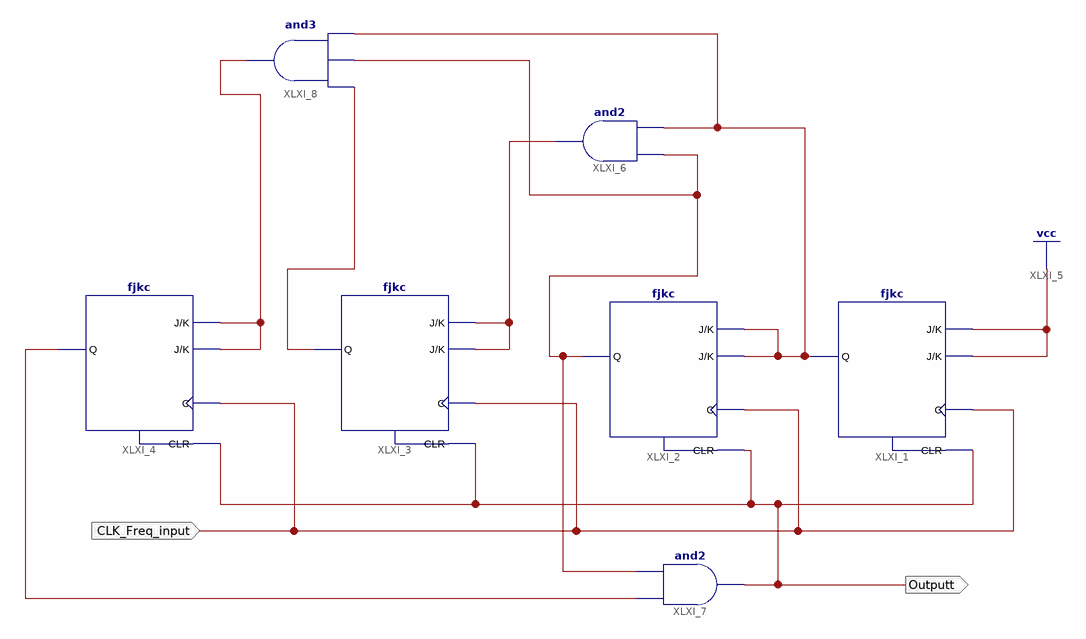
[diagram p0: schematic sheet 1]
// Xilinx ISE schematic mod10.sch (spartan6) as structural Verilog: 7 symbols, 2 ports
module mod10 (
  input  CLK_Freq_input,
  output Outputt
);

  wire XLXN_4, XLXN_10, XLXN_13, XLXN_16, XLXN_23, XLXN_24;

  fjkc XLXI_1 (.C(CLK_Freq_input), .CLR(Outputt), .J(1'b1), .K(1'b1), .Q(XLXN_4));
  fjkc XLXI_2 (.C(CLK_Freq_input), .CLR(Outputt), .J(XLXN_4), .K(XLXN_4), .Q(XLXN_23));
  fjkc XLXI_3 (.C(CLK_Freq_input), .CLR(Outputt), .J(XLXN_10), .K(XLXN_10), .Q(XLXN_13));
  fjkc XLXI_4 (.C(CLK_Freq_input), .CLR(Outputt), .J(XLXN_16), .K(XLXN_16), .Q(XLXN_24));
  and XLXI_6 (XLXN_10, XLXN_4, XLXN_23);
  and XLXI_7 (Outputt, XLXN_24, XLXN_23);
  and XLXI_8 (XLXN_16, XLXN_4, XLXN_23, XLXN_13);
endmodule
